# Altium schematic sheet SEP00000AG.SCHDOC
size A3; PageSetup: Record=PageOptions|CenterHorizontal=True|CenterVertical=True|PrintScale=0.70|XCorrection=1.00|YCorrection=1.00|PrintKind=0|BorderSize=5000000|LeftOffset=0|BottomOffset=0|Orientation=2|PaperLength=1000|PaperWidth=1000|Scale=100|PaperSource=7|PrintQuality=-4|MediaType=1|DitherType=10|PaperKind=A4|PrintScaleMode=1
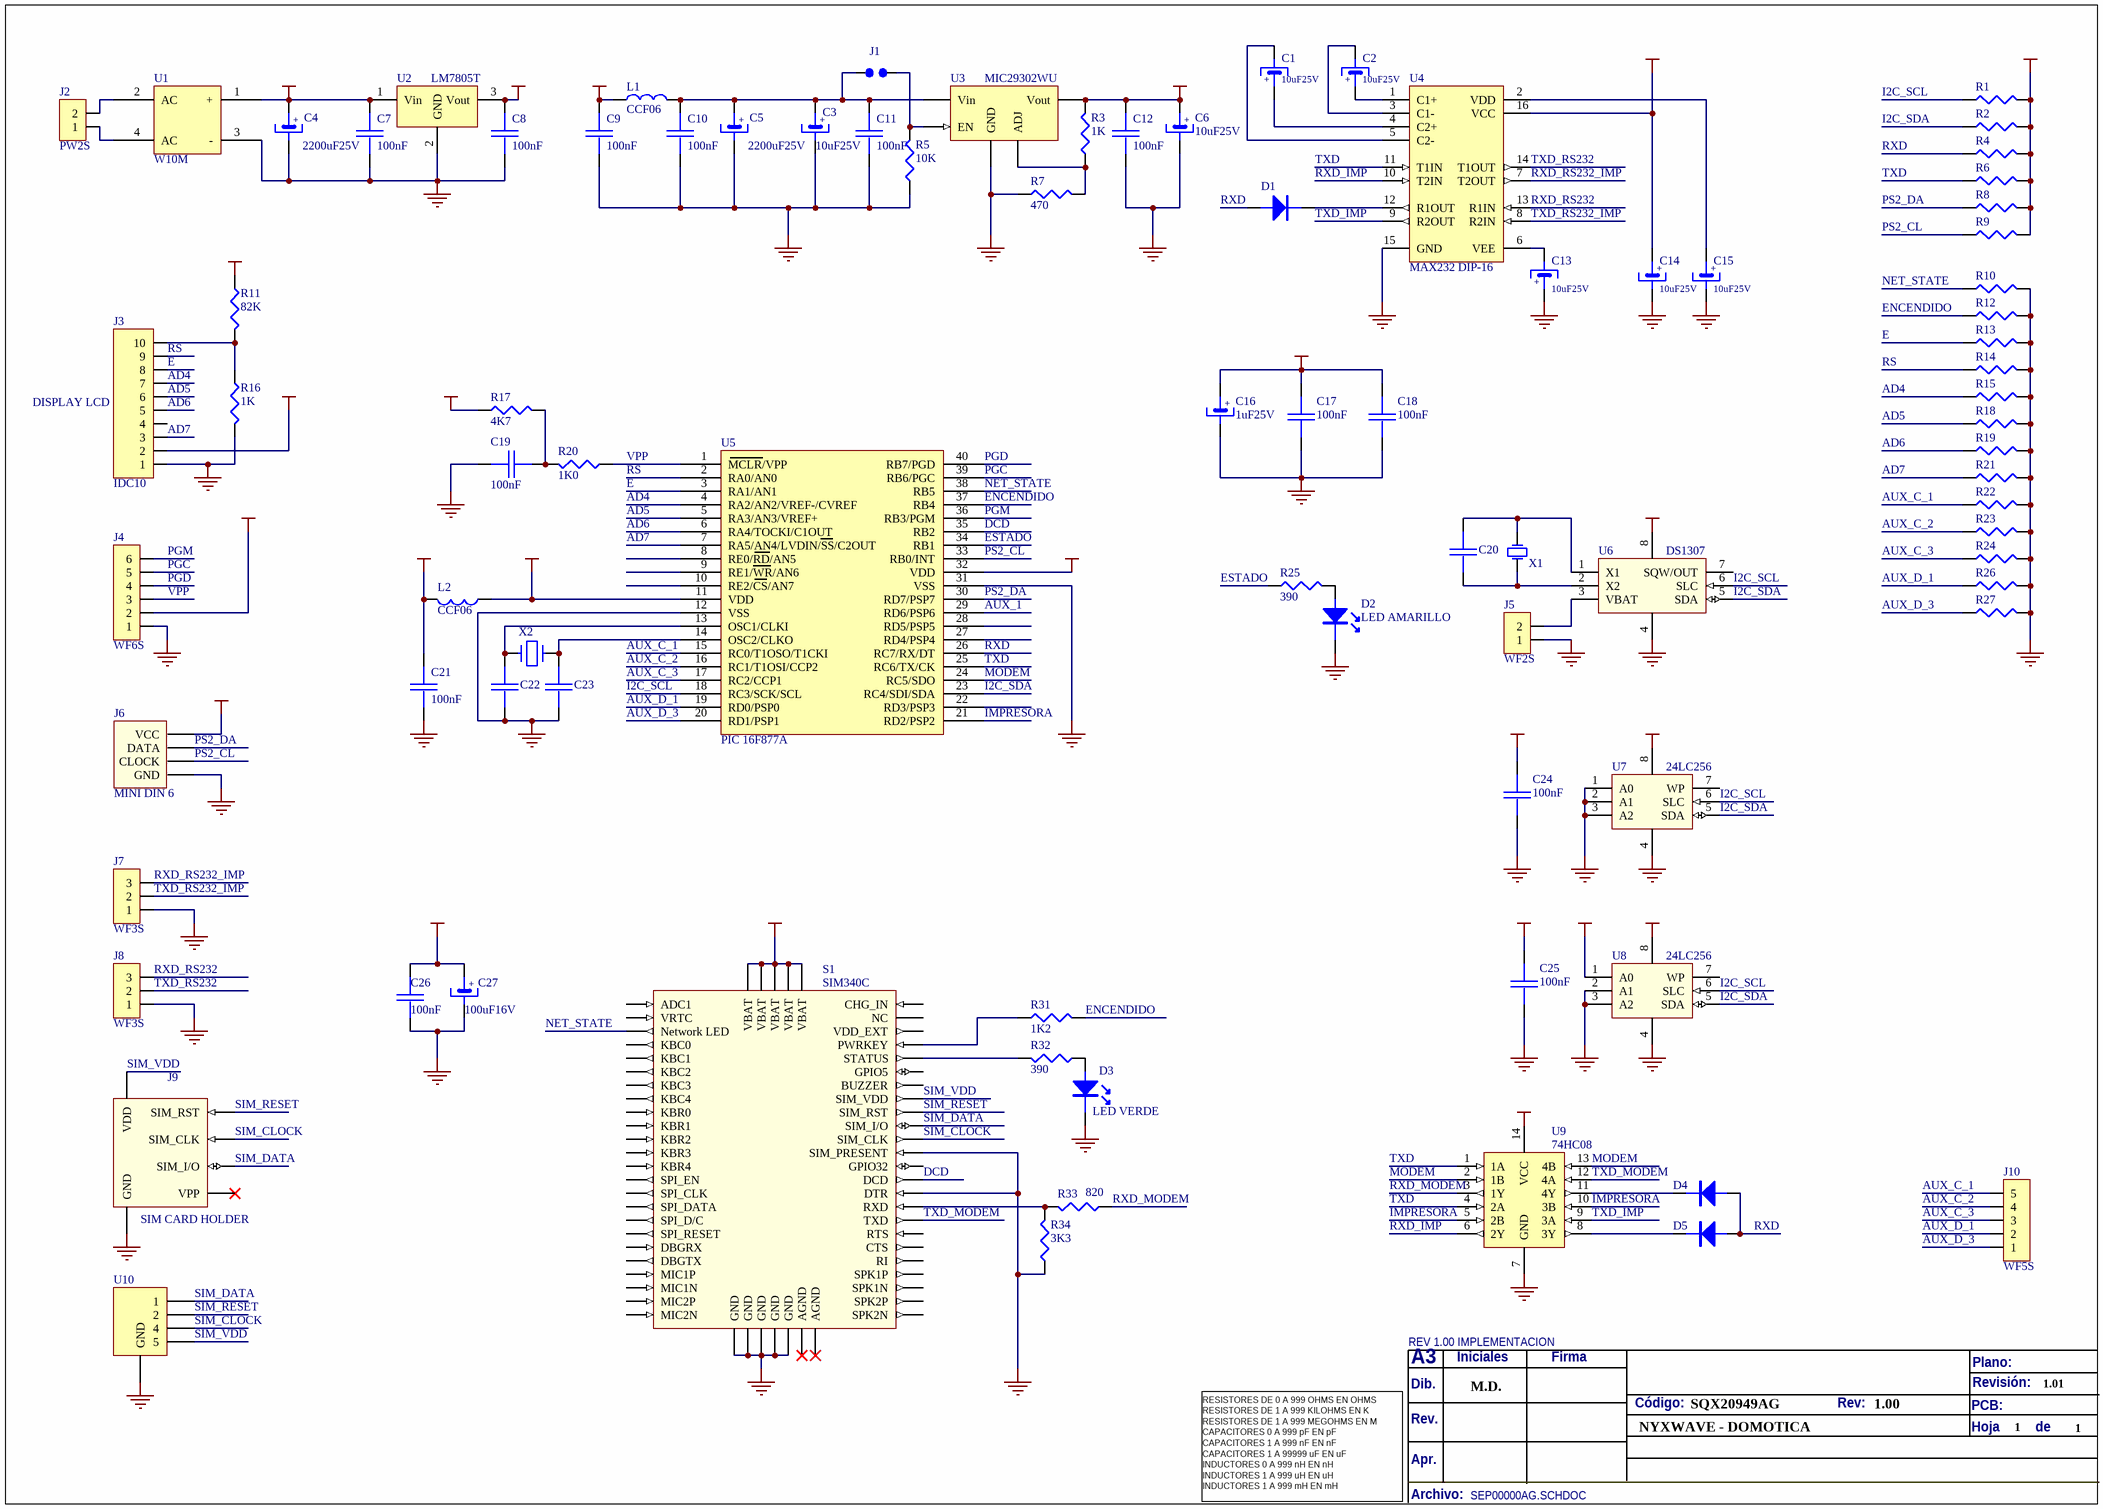
[diagram p0: SEP00000AG.SCHDOC]

## Parts
C1  10uF25V  [CE 2.0/5.0]
C2  10uF25V  [CE 2.0/5.0]
C3  10uF25V  [CE 1.5/4.0]
C4  2200uF25V  [CE 5.0/12.5]
C5  2200uF25V  [CE 5.0/12.5]
C6  10uF25V  [CE 1.5/4.0]
C7  100nF  [0805]
C8  100nF  [0805]
C9  100nF  [0805]
C10  100nF  [0805]
C11  100nF  [0805]
C12  100nF  [0805]
C13  10uF25V  [CE 2.0/5.0]
C14  10uF25V  [CE 2.0/5.0]
C15  10uF25V  [CE 2.0/5.0]
C16  1uF25V  [CE 2.5/5.0]
C17  100nF  [0805]
C18  100nF  [0805]
C19  100nF  [0805]
C20  15p  [CAP2.54]  (value not drawn)
C21  100nF  [0805]
C22  15p  [CAP2.54]  (value not drawn)
C23  15p  [CAP2.54]  (value not drawn)
C24  100nF  [0805]
C25  100nF  [0805]
C26  100nF  [0805]
C27  100uF16V  [CE 3.5/8.0]
D1  1N4148 DO-35  [DO-35_200]  (value not drawn)
D2  LED AMARILLO  [LED 3MM]
D3  LED VERDE  [LED 3MM]
D4  1N4148 DO-35  [DO-35_200]  (value not drawn)
D5  1N4148 DO-35  [DO-35_200]  (value not drawn)
J1  Jumper  [IDC2]  (value not drawn)
J2  PW2S  [PW2S]
J3  IDC10  [IDC10]
J4  WF6S  [WF6S]
J5  WF2S  [WF2S]
J6  MINI DIN 6  [MINI DIN PCB]
J7  WF3S  [WF3S]
J8  WF3S  [WF3S]
J9  SIM CARD HOLDER  [SIM CARD HOLDER]
J10  WF5S  [WF5S]
L1  CCF06  [AXIAL10X4_300]
L2  CCF06  [AXIAL10X4_300]
R1  10K  [0805]  (value not drawn)
R2  10K  [0805]  (value not drawn)
R3  1K  [RES_MF1/2W_200]
R4  100K  [0805]  (value not drawn)
R5  10K  [0805]
R6  100K  [0805]  (value not drawn)
R7  470  [RES_MF1/2W_200]
R8  5K6  [0805]  (value not drawn)
R9  5K6  [0805]  (value not drawn)
R10  5K6  [0805]  (value not drawn)
R11  82K  [RES_MF1/2W_200]
R12  5K6  [0805]  (value not drawn)
R13  5K6  [0805]  (value not drawn)
R14  5K6  [0805]  (value not drawn)
R15  5K6  [0805]  (value not drawn)
R16  1K  [RES_MF1/2W_200]
R17  4K7  [RES_MF1/2W_200]
R18  5K6  [0805]  (value not drawn)
R19  5K6  [0805]  (value not drawn)
R20  1K0  [0805]
R21  5K6  [0805]  (value not drawn)
R22  8K2  [0805]  (value not drawn)
R23  8K2  [0805]  (value not drawn)
R24  8K2  [0805]  (value not drawn)
R25  390  [RES_MF1/2W_200]
R26  8K2  [0805]  (value not drawn)
R27  8K2  [0805]  (value not drawn)
R31  1K2  [0805]
R32  390  [RES_MF1/2W_200]
R33  820  [RES_MF1/2W_200]
R34  3K3  [RES_MF1/2W_200]
S1  SIM340C  [SIM340C]
U1  W10M  [CASE22]
U2  LM7805T  [TO-220_1]
U3  MIC29302WU  [TO-220-5S]
U4  MAX232 DIP-16  [DIP16]
U5  PIC 16F877A  [DIP40]
U6  DS1307  [DIP8]
U7  24LC256  [DIP8]
U8  24LC256  [DIP8]
U9  74HC08  [DIP14]
U10  ESDA6V1W5  [SOT-323-5L]  (value not drawn)
X1  XL20M-UM5  [UM5]  (value not drawn)
X2  20MHz  [UM5]  (value not drawn)

## Nets
+5V: C8.2 C14.1 C21.2 C24.2 C25.2 J3.2 J6.4(VCC) L2.2 R1.2 R2.2 R4.2 R6.2 R8.2 R9.2 R11.2 R17.1 U2.3(Vout) U4.16(VCC) U6.8(VCC) U7.8(VCC) U8.1(A0) U8.8(VCC) U9.14(VCC)
GND: C3.2 C4.2 C5.2 C6.2 C7.1 C8.1 C9.1 C10.1 C11.1 C12.1 C13.1 C14.2 C15.2 C16.2 C17.2 C18.1 C19.1 C21.1 C22.1 C23.1 C24.1 C25.1 C26.1 C27.2 D2.K D3.K J3.1 J4.1 J5.1 J6.3(GND) J7.1 J8.1 J9.4(GND) R5.1 R7.1 R10.2 R12.2 R13.2 R14.2 R15.2 R16.1 R18.2 R19.2 R21.2 R22.2 R23.2 R24.2 R26.2 R27.2 R34.1 S1.2(GND) S1.4(GND) S1.6(GND) S1.8(GND) S1.10(GND) S1.33(SIM_PRESENT) S1.39(DTR) U1.3(-) U2.2(GND) U3.3(GND) U4.15(GND) U5.12(VSS) U5.31(VSS) U6.4(VSS) U7.1(A0) U7.2(A1) U7.3(A2) U7.4(VSS) U8.2(A1) U8.3(A2) U8.4(VSS) U9.7(GND) U10.3(GND)
VBAT: C6.1 C12.2 C26.2 C27.1 R3.2 S1.1(VBAT) S1.3(VBAT) S1.5(VBAT) S1.7(VBAT) S1.9(VBAT) U3.4(Vout)
VCC: C4.1 C7.2 C9.2 L1.1 U1.1(+) U2.1(Vin)
VDD: C16.1 C17.1 C18.2 J4.2 L2.1 U5.11(VDD) U5.32(VDD)
AD4: J3.7 R15.1 U5.4(RA2/AN2/VREF-/CVREF)
AD5: J3.6 R18.1 U5.5(RA3/AN3/VREF+)
AD6: J3.5 R19.1 U5.6(RA4/TOCKI/C1OUT)
AD7: J3.3 R21.1 U5.7(RA5/AN4/LVDIN/SS/C2OUT)
AUX_1: U5.29(RD6/PSP6)
AUX_C_1: J10.5 R22.1 U5.15(RC0/T1OSO/T1CKI)
AUX_C_2: J10.4 R23.1 U5.16(RC1/T1OSI/CCP2)
AUX_C_3: J10.3 R24.1 U5.17(RC2/CCP1)
AUX_D_1: J10.2 R26.1 U5.19(RD0/PSP0)
AUX_D_3: J10.1 R27.1 U5.20(RD1/PSP1)
DCD: S1.37(DCD) U5.35(RB2)
E: J3.8 R13.1 U5.3(RA1/AN1)
ENCENDIDO: R12.1 R31.2 U5.37(RB4)
ESTADO: R25.1 U5.34(RB1)
I2C_SCL: R1.1 U5.18(RC3/SCK/SCL) U6.6(SLC) U7.6(SLC) U8.6(SLC)
I2C_SDA: R2.1 U5.23(RC4/SDI/SDA) U6.5(SDA) U7.5(SDA) U8.5(SDA)
IMPRESORA: U5.21(RD2/PSP2) U9.5(2B) U9.10(3B)
MODEM: U5.24(RC5/SDO) U9.2(1B) U9.13(4B)
NET_STATE: R10.1 S1.16(Network_LED) U5.38(RB5)
PGC: J4.5 U5.39(RB6/PGC)
PGD: J4.4 U5.40(RB7/PGD)
PGM: J4.6 U5.36(RB3/PGM)
PS2_CL: J6.5(CLOCK) R9.1 U5.33(RB0/INT)
PS2_DA: J6.1(DATA) R8.1 U5.30(RD7/PSP7)
RS: J3.9 R14.1 U5.2(RA0/AN0)
RXD: D1.A D4.A D5.A R4.1 U5.26(RC7/RX/DT)
RXD_IMP: U4.10(T2IN) U9.6(2Y)
RXD_MODEM: R33.1 U9.3(1Y)
RXD_RS232: J8.3 U4.13(R1IN)
RXD_RS232_IMP: J7.3 U4.7(T2OUT)
SIM_CLOCK: J9.3(SIM_CLK) S1.31(SIM_CLK) U10.4
SIM_DATA: J9.6(SIM_I/O) S1.29(SIM_I/O) U10.1
SIM_RESET: J9.2(SIM_RST) S1.27(SIM_RST) U10.2
SIM_VDD: J9.1(VDD) S1.25(SIM_VDD) U10.5
TXD: R6.1 U4.11(T1IN) U5.25(RC6/TX/CK) U9.1(1A) U9.4(2A)
TXD_IMP: U4.9(R2OUT) U9.9(3A)
TXD_MODEM: S1.43(TXD) U9.12(4A)
TXD_RS232: J8.2 U4.14(T1OUT)
TXD_RS232_IMP: J7.2 U4.8(R2IN)
VPP: J4.3 R20.1 U5.1(MCLR/VPP)
NetC1_1: C1.1 U4.4(C2+)
NetC1_2: C1.2 U4.5(C2-)
NetC2_1: C2.1 U4.1(C1+)
NetC2_2: C2.2 U4.3(C1-)
NetC3_1: C3.1 C5.1 C10.2 C11.2 J1.2 L1.2 U3.2(Vin)
NetC13_2: C13.2 U4.6(VEE)
NetC15_1: C15.1 U4.2(VDD)
NetC19_2: C19.2 R17.2 R20.2
NetC20_1: C20.1 U6.2(X2) X1.1(OSC1)
NetC20_2: C20.2 U6.1(X1) X1.2(OSC2)
NetC22_2: C22.2 U5.13(OSC1/CLKI) X2.2
NetC23_2: C23.2 U5.14(OSC2/CLKO) X2.1
NetD1_K: D1.K U4.12(R1OUT)
NetD2_A: D2.A R25.2
NetD3_A: D3.A R32.1
NetD4_K: D4.K U9.11(4Y)
NetD5_K: D5.K U9.8(3Y)
NetJ1_1: J1.1 R5.2 U3.1(EN)
NetJ2_1: J2.1 U1.4(AC)
NetJ2_2: J2.2 U1.2(AC)
NetJ3_10: J3.10 R11.1 R16.2
NetJ5_2: J5.2 U6.3(VBAT)
NetR3_1: R3.1 R7.2 U3.5(ADJ)
NetR31_1: R31.1 S1.17(PWRKEY)
NetR32_2: R32.2 S1.19(STATUS)
NetR33_2: R33.2 R34.2 S1.41(RXD)

Not connected (* = marked no-connect by the designer): J3 4; J9 5(VPP)*; S1 11(CHG_IN) 12(ADC1) 13(NC) 14(VRTC) 15(VDD_EXT) 18(KBC0) 20(KBC1) 21(GPIO5) 22(KBC2) 23(BUZZER) 24(KBC3) 26(KBC4) 28(KBR0) 30(KBR1) 32(KBR2) 34(KBR3) 35(GPIO32) 36(KBR4) 38(SPI_EN) 40(SPI_CLK) 42(SPI_DATA) 44(SPI_D/C) 45(RTS) 46(SPI_RESET) 47(CTS) 48(DBGRX) 49(RI) 50(DBGTX) 51(AGND)* 52(AGND)* 53(SPK1P) 54(MIC1P) 55(SPK1N) 56(MIC1N) 57(SPK2P) 58(MIC2P) 59(SPK2N) 60(MIC2N); U5 8(RE0/RD/AN5) 9(RE1/WR/AN6) 10(RE2/CS/AN7) 22(RD3/PSP3) 27(RD4/PSP4) 28(RD5/PSP5); U6 7(SQW/OUT); U7 7(WP); U8 7(WP)

## Notes on the sheet
- DISPLAY LCD
- Labels drawn without touching a wire or pin: 1, 1.00, 1.01, M.D., SQX20949AG
- REV 1.00 IMPLEMENTACION
- Dib.
- A3
- Iniciales
- Firma
- Plano:
- Revisión:
- Rev.
- Apr.
- Código:
- Rev:
- Hoja          de
- PCB:
- RESISTORES DE 0 A 999 OHMS EN OHMS
  RESISTORES DE 1 A 999 KILOHMS EN K
  RESISTORES DE 1 A 999 MEGOHMS EN M
  CAPACITORES 0 A 999 pF EN pF
  CAPACITORES 1 A 999 nF EN nF
  CAPACITORES 1 A 99999 uF EN uF
  INDUCTORES 0 A 999 nH EN nH
  INDUCTORES 1 A 999 uH EN uH
  INDUCTORES 1 A 999 mH EN mH
- Archivo:
- (in symbol 1uF25V) +
- (in symbol 10uF25V 4X7X1.5) +
- (in symbol 10uF25V 5X11X2) +
- (in symbol 100uF16V) +
- (in symbol 2200uF25V) +

## Library data of the parts
C1 C2 C13-C15 = 10uF25V 5X11X2: CAPACITOR ELECTROLITICO RADIAL 5X11mm PASO 2mm 85ªC +/-20 25V 10uF; CODIGO: YEAF106EBG
C3 C6 = 10uF25V 4X7X1.5: CAPACITOR ELECTROLITICO RADIAL 5X7mm PASO 1.5mm 85ªC +/-20 25V 10uF; CODIGO: YEAC106EBG
C4 C5 = 2200uF25V: CAPACITOR ELECTROLITICO RADIAL 12.5X26 mm PASO 5 mm +/-20% 85ºC 25V 2200uF
C7-C12 C17-C19 C21 C24-C26 = 100n: CAPACITOR SMD 0805 X7R  50 V 100 nF; CODIGO: YSBC104AAG
C16 = 1uF25V: CAP ELECT RAD 1.0UF 25V 5X11MM PASO 2MM 85ºC; CODIGO: YEAF105EBG
C20 C22 C23 = 15p: CAPACITOR CERAMICO DISCO 2.54 mm  X7R  50V  15pF; CODIGO: YCAC150AAG
C27 = 100uF16V: CAP ELECT RADIAL 100UF 16V 6.3X12MM PASO 2.5MM 85ºC 20%; CODIGO: YEAI107DBG
D1 D4 D5 = 1N4148 DO-35: 1N4148 DO-35 DIODO; CODIGO: DR00006ABH
D2 = LED AMARILLO 3MM: CODIGO: DLRA030XCG
D3 = LED VERDE 3MM: CODIGO: DLRV030XCG
J1 = Jumper: CODIGO: XXX00005XX
J2 = PW2S: PW2S HEADER .156" RECTO 2 VIAS; CODIGO: JNXEISP02G
J3 = IDC10: CONECTOR IDC HEMBRA PCB NO POLARIZADO PASO 2.54 mm RECTO 2X5 VIAS; CODIGO: JNXJDSP10G
J4 = WF6S: WF6S CONECTOR MACHO PASO 2.54 MM  6 VIAS RECTO; CODIGO: JCXGASP06G
J5 = WF2S: WF2S HEADER .100" RECTO 2 VIAS; CODIGO: JCXGASP02G
J6 = CONECTOR MINI DIN 6: CONECTOR MINI DIN 6 PARA PCB; CODIGO: XXX00000xx
J7 J8 = WF3S: WF3S HEADER .100" RECTO 3 VIAS; CODIGO: JCXGASP03G
J9 = SIM CARD HOLDER: ZOCALO PARA TARJETA DE MEMORIA SIM; CODIGO: XXX00001XX
J10 = WF5S: WF5S HEADER .100" RECTO 5 VIAS; CODIGO: JCXGASP05G
L1 = CCF06: INDUCTOR CCF06; CODIGO: LC0000003G
L2 = CCF06: INDUCTOR CCF06; CODIGO: LV0000003G
R1 R2 R5 = 10K: RESISTOR SMD0805 0.125 W 5%  10 K OHMS; CODIGO: RSB00103EG
R3 R16 = 1K: RESISTOR METAL FILM 0.5 W 5% 1 K OHMS; CODIGO: RMC00102EG
R4 R6 = 100K: RESISTOR SMD0805 0.125 W 5%  100 K OHMS; CODIGO: RSB00104EG
R7 = 470: RESISTOR METAL FILM 0.5 W 5% 470 OHMS; CODIGO: RMC00471EG
R8-R10 R12-R15 R18 R19 R21 = 5K6: RESISTOR SMD0805 0.125 W 5%  5.6 K OHMS; CODIGO: RSB00562EG
R11 = 82K: RESISTOR METAL FILM 0.5 W 5% 82 KILOHMS; CODIGO: RMC00823EG
R17 = 4K7: RESISTOR METAL FILM 0.5 W 5% 4.7 KILOHMS; CODIGO: RMC00472EG
R20 = 1K0: RESISTOR SMD0805 0.125 W 5%  1 K OHMS; CODIGO: RSB00102EG
R22-R24 R26 R27 = 8K2: RESISTOR SMD0805 0.125 W 5%  8.2 K OHMS; CODIGO: RSB00822EG
R25 R32 = 390: RESISTOR METAL FILM 0.5 W 5% 390 OHMS; CODIGO: RMC00391EG
R31 = 1K2: RESISTOR SMD0805 0.125 W 5%  1.2 K OHMS; CODIGO: RSB00122EG
R33 = 820: RESISTOR METAL FILM 0.5 W 5% 820 OHMS; CODIGO: RMC00821EG
R34 = 3K3: RESISTOR METAL FILM 0.5 W 5% 3.3 KILOHMS; CODIGO: RMC00332EG
S1 = SIM340C QUAD-BAND GSM/GPRS: SIM340C QUAD-BAND GSM/GPRS GSM850MHz/EGSM900MHz/DCS18000MHz/PCS1900MHz; CODIGO: XXXXXXXXXX
U1 = W10M: W10M CASE22 CIRC INT RECTIFICADOR PUENTE 1000V 1A; CODIGO: UU00004HAH
U2 = LM7805T: LM7805T TO-220 CIRC INT; CODIGO: UV00001EBG
U3 = MIC29302WU: MIC29302WU TO-220 (T) HIGH CURRENT LOW DROPOUT REGULATORS; CODIGO: XXXXXXXXX1
U4 = MAX232 DIP-16: MAX232 DIP-16 CIRCUITO INTEGRADO; CODIGO: UZ00013AGH
U5 = PIC 16F877A: PIC16F877A-I/P DIP-40 MICROCHIP; CODIGO: UI00012AGH
U6 = DS1307: 64 X 8 SERIAL REAL TIME CLOCK
U7 U8 = 24LC256: 256K I2C CMOS Serial EEPROM; CODIGO: XXX00004XX
U9 = 74HC08 DIP: 74HC08 DIP-14 QUAD 2-INPUT AND GATE; CODIGO: UD00049AFH
U10 = ESDA6V1W5: ESDA6V1W5 ARRAY  FOR ESD PROTECTION; CODIGO: XXX00003XX
X1 = XL20M-UM5: XL20M-UM5 CRISTAL DE 20 MHZ 10ppm
X2 = CRYSTAL: 20.000 MHZ XL20M-UM5 10PPM CRISTAL; CODIGO: XXAC00012H